# Altium schematic sheet [07] - LIGHTS.SchDoc: X
size A4; Date: DD-MM-YYYY; CheckedBy: X; DrawnBy: Y; Revision: 0.0.0; SheetNumber: X; SheetTotal: Y; Projectnumber: OWN-000; Size: A4; Contact: datasystem.pl; Projectname: X
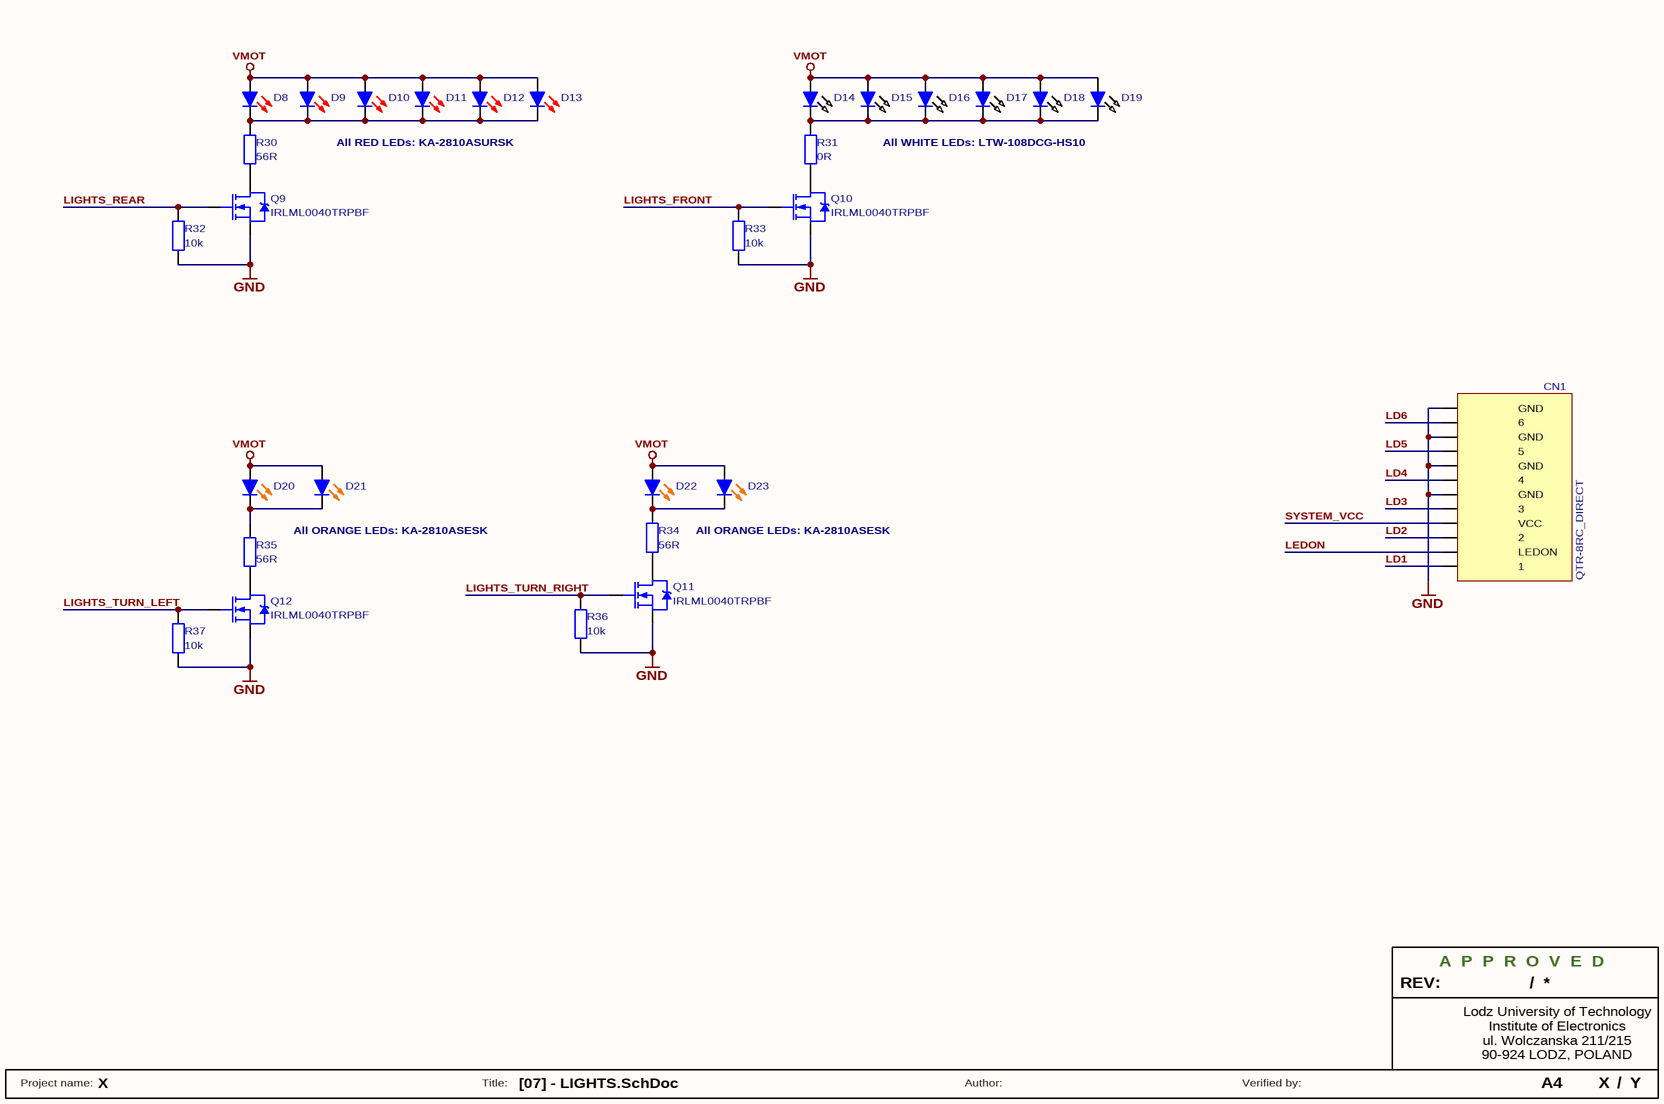
[diagram p0: [07] - LIGHTS.SchDoc]

## Parts
CN1  QTR-8RC_DIRECT  [QTR-8RC_SNAPPED_GOLDPIN_VERTICAL]
D8  KA-2810ASURSK  [LED2810]  (value not drawn)
D9  KA-2810ASURSK  [LED2810]  (value not drawn)
D10  KA-2810ASURSK  [LED2810]  (value not drawn)
D11  KA-2810ASURSK  [LED2810]  (value not drawn)
D12  KA-2810ASURSK  [LED2810]  (value not drawn)
D13  KA-2810ASURSK  [LED2810]  (value not drawn)
D14  LTW-108DCG-HS10  [LED2810]  (value not drawn)
D15  LTW-108DCG-HS10  [LED2810]  (value not drawn)
D16  LTW-108DCG-HS10  [LED2810]  (value not drawn)
D17  LTW-108DCG-HS10  [LED2810]  (value not drawn)
D18  LTW-108DCG-HS10  [LED2810]  (value not drawn)
D19  LTW-108DCG-HS10  [LED2810]  (value not drawn)
D20  KA-2810ASESK  [LED2810]  (value not drawn)
D21  KA-2810ASESK  [LED2810]  (value not drawn)
D22  KA-2810ASESK  [LED2810]  (value not drawn)
D23  KA-2810ASESK  [LED2810]  (value not drawn)
Q9  IRLML0040TRPBF  [SOT-23]
Q10  IRLML0040TRPBF  [SOT-23]
Q11  IRLML0040TRPBF  [SOT-23]
Q12  IRLML0040TRPBF  [SOT-23]
R30  56R  [R0805]
R31  0R  [R0805]
R32  10k  [R0805]
R33  10k  [R0805]
R34  56R  [R0805]
R35  56R  [R0805]
R36  10k  [R0805]
R37  10k  [R0805]

## Nets
GND: CN1.GND Q9.2(S) Q10.2(S) Q11.2(S) Q12.2(S) R32.2 R33.2 R36.2 R37.2
VMOT: D8.2(A) D9.2(A) D10.2(A) D11.2(A) D12.2(A) D13.2(A) D14.2(A) D15.2(A) D16.2(A) D17.2(A) D18.2(A) D19.2(A) D20.2(A) D21.2(A) D22.2(A) D23.2(A)
LD1: CN1.1
LD2: CN1.2
LD3: CN1.3
LD4: CN1.4
LD5: CN1.5
LD6: CN1.6
LEDON: CN1.LEDON
LIGHTS_FRONT: Q10.1(G) R33.1
LIGHTS_REAR: Q9.1(G) R32.1
LIGHTS_TURN_LEFT: Q12.1(G) R37.1
LIGHTS_TURN_RIGHT: Q11.1(G) R36.1
SYSTEM_VCC: CN1.VCC
NetD8_1: D8.1(K) D9.1(K) D10.1(K) D11.1(K) D12.1(K) D13.1(K) R30.1
NetD14_1: D14.1(K) D15.1(K) D16.1(K) D17.1(K) D18.1(K) D19.1(K) R31.1
NetD20_1: D20.1(K) D21.1(K) R35.1
NetD22_1: D22.1(K) D23.1(K) R34.1
NetQ9_3: Q9.3(D) R30.2
NetQ10_3: Q10.3(D) R31.2
NetQ11_3: Q11.3(D) R34.2
NetQ12_3: Q12.3(D) R35.2

## Notes on the sheet
- All RED LEDs: KA-2810ASURSK
- All WHITE LEDs: LTW-108DCG-HS10
- All ORANGE LEDs: KA-2810ASESK
- REV:
- A  P  P  R  O  V  E  D
- /
- Lodz University of Technology
- ul. Wolczanska 211/215
- 90-924 LODZ, POLAND
- Institute of Electronics
- Project name:
- Title:
- Author:
- Verified by:

## Library data of the parts
CN1 = QTR-8RC_DIRECT: QTR-8RC Reflectance Sensor Array (Pololu item No. 961); Published: 14-Sep-2006
Q9-Q12 = IRLML0040TRPBF: N-Channel; 40V, 3.6A, 1,25W; HEXFET Power MOS-FET; Supplier 1: Farnell; Supplier 2: TME; Supplier 3: Farnell; Supplier 4: Farnell; Supplier Part Number 1: 1831088RL; Supplier Part Number 2: IRLML0040TRPBF; Supplier Part Number 3: 1829136; Supplier Part Number 4: 1831088
R30-R37 = Res: Resistor; Published: 19-Feb-2006; ComponentLink1Description: datasheet; ComponentLink2Description: supplier
  R30 R34 R35: Value: 56R
  R31: Value: 0R
  R32 R33 R36 R37: Value: 10k
D8-D13 = KA-2810ASURSK: Published: 04-Apr-2006
D14-D19 = LTW-108DCG-HS10: Published: 04-Apr-2006
D20-D23 = KA-2810ASESK: Published: 04-Apr-2006